# Altium schematic sheet Serializer_DS90UB913A.SchDoc
size A3; SheetNumber: 1; SheetTotal: 6
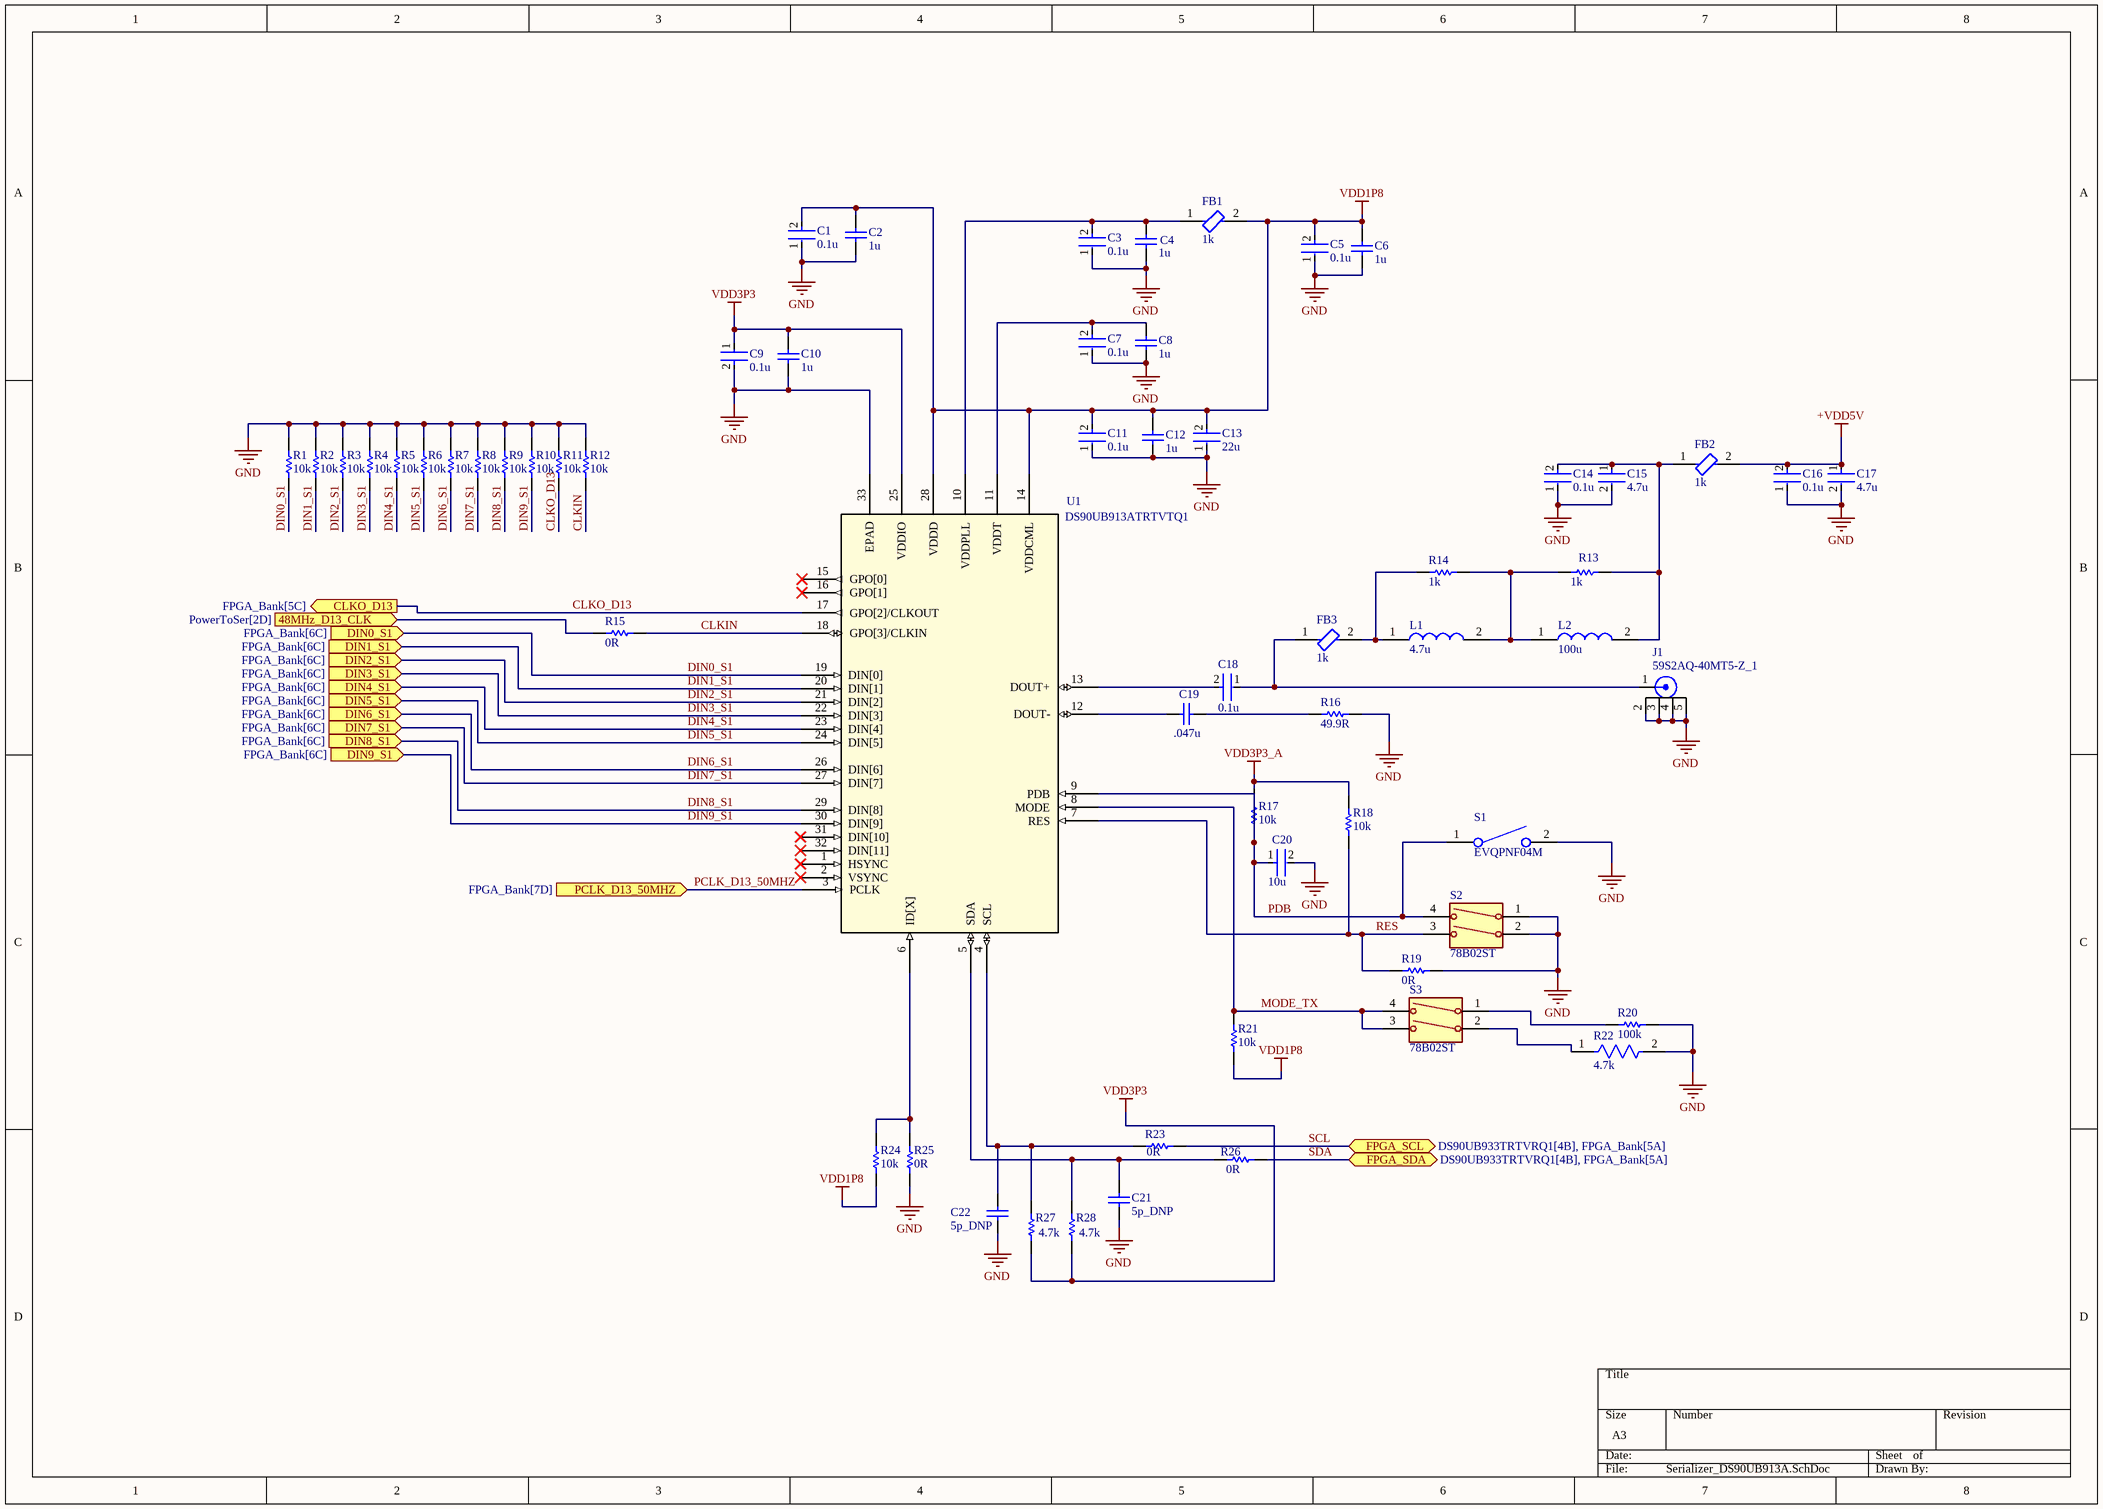
[diagram p0: Serializer_DS90UB913A.SchDoc]

## Parts
C1  0.1u  [FP-GRM15-MFG]
C2  1u  [CAPC1608X90X35ML10T15]
C3  0.1u  [FP-GRM15-MFG]
C4  1u  [CAPC1608X90X35ML10T15]
C5  0.1u  [FP-GRM15-MFG]
C6  1u  [CAPC1608X90X35ML10T15]
C7  0.1u  [FP-GRM15-MFG]
C8  1u  [CAPC1608X90X35ML10T15]
C9  0.1u  [FP-GRM15-MFG]
C10  1u  [CAPC1608X90X35ML10T15]
C11  0.1u  [FP-GRM15-MFG]
C12  1u  [CAPC1608X90X35ML10T15]
C13  22u  [FP-GCM32E-0_3-IPC_B]
C14  0.1u  [FP-GRM15-MFG]
C15  4.7u  [FP-GRM21B-0_15-MFG]
C16  0.1u  [FP-GRM15-MFG]
C17  4.7u  [FP-GRM21B-0_15-MFG]
C18  0.1u  [FP-GRM15-MFG]
C19  .047u  [CAPC1608X90X35ML10T15]
C20  10u  [FP-GRM21B-0_1-IPC_C]
C21  5p_DNP  [CAPC1005X55X25LL05T10]
C22  5p_DNP  [CAPC1005X55X25LL05T10]
FB1  1k  [FP-BLM18-0_15-t0_8-MFG]
FB2  1k  [FP-BLM18-0_15-t0_8-MFG]
FB3  1k  [FP-BLM18-0_15-t0_8-MFG]
J1  59S2AQ-40MT5-Z_1  [ROSENBERGER_59S2AQ-40MT5-Z_1]
L1  4.7u  [1008PS]
L2  100u  [MSS7341T104MLB]
R1  10k  [RESC1005X40X25ML05T05]
R2  10k  [RESC1005X40X25ML05T05]
R3  10k  [RESC1005X40X25ML05T05]
R4  10k  [RESC1005X40X25ML05T05]
R5  10k  [RESC1005X40X25ML05T05]
R6  10k  [RESC1005X40X25ML05T05]
R7  10k  [RESC1005X40X25ML05T05]
R8  10k  [RESC1005X40X25ML05T05]
R9  10k  [RESC1005X40X25ML05T05]
R10  10k  [RESC1005X40X25ML05T05]
R11  10k  [RESC1005X40X25ML05T05]
R12  10k  [RESC1005X40X25ML05T05]
R13  1k  [RESC1608X55X30LL15T15]
R14  1k  [RESC1608X55X30LL15T15]
R15  0R  [RESC1005X40X25LL05T05]
R16  49.9R  [RESC1608X55X30ML15T15]
R17  10k  [RESC1005X40X25ML05T05]
R18  10k  [RESC1005X40X25ML05T05]
R19  0R  [RESC1005X40X25LL05T05]
R20  100k  [RESC2013X70X40ML20T20]
R21  10k  [RESC1005X40X25ML05T05]
R22  4.7k  [FP-ERJ6GE-MFG]
R23  0R  [RESC1005X40X25LL05T05]
R24  10k  [RESC1005X40X25ML05T05]
R25  0R  [RESC1005X40X25LL05T05]
R26  0R  [RESC1005X40X25LL05T05]
R27  4.7k  [RESC1005X40X25LL05T05]
R28  4.7k  [RESC1005X40X25LL05T05]
S1  EVQPNF04M  [EVQ5PN05K]
S2  78B02ST  [78B02ST]
S3  78B02ST  [78B02ST]
U1  DS90UB913ATRTVTQ1  [RTV32_3P1X3P1_TEX]

## Ports
48MHz_D13_CLK (in, see PowerToSer[2D]), CLKO_D13 (out, see FPGA_Bank[5C]), DIN0_S1 (in, see FPGA_Bank[6C]), DIN1_S1 (in, see FPGA_Bank[6C]), DIN2_S1 (in, see FPGA_Bank[6C]), DIN3_S1 (in, see FPGA_Bank[6C]), DIN4_S1 (in, see FPGA_Bank[6C]), DIN5_S1 (in, see FPGA_Bank[6C]), DIN6_S1 (in, see FPGA_Bank[6C]), DIN7_S1 (in, see FPGA_Bank[6C]), DIN8_S1 (in, see FPGA_Bank[6C]), DIN9_S1 (in, see FPGA_Bank[6C]), FPGA_SCL (bidir, see DS90UB933TRTVRQ1[4B], FPGA_Bank[5A]), FPGA_SDA (bidir, see DS90UB933TRTVRQ1[4B], FPGA_Bank[5A]), PCLK_D13_50MHZ (in, see FPGA_Bank[7D])

## Nets
+VDD5V: C16.2 C17.1 FB2.2
GND: C1.1 C2.1 C3.1 C4.1 C5.1 C6.1 C7.1 C8.1 C9.2 C10.1 C11.1 C12.1 C13.1 C14.1 C15.2 C16.1 C17.2 C20.2 C21.1 C22.1 J1.2 J1.3 J1.4 J1.5 R1.2 R2.2 R3.2 R4.2 R5.2 R6.2 R7.2 R8.2 R9.2 R10.2 R11.2 R12.2 R16.2 R19.1 R20.2 R22.2 R25.1 S1.2(NO) S2.1(COM_1) S2.2(NO_1) U1.33(EPAD)
VDD1P8: C1.2 C2.2 C5.2 C6.2 C11.2 C12.2 C13.2 FB1.2 R21.1 R24.1 U1.14(VDDCML) U1.28(VDDD)
VDD3P3: C9.1 C10.2 R27.1 R28.1 U1.25(VDDIO)
VDD3P3_A: R17.2 R18.2
48MHz_D13_CLK: R15.2 ; port 48MHz_D13_CLK
CLKIN: R12.1 R15.1 U1.18(GPO[3]/CLKIN)
CLKO_D13: R11.1 U1.17(GPO[2]/CLKOUT) ; port CLKO_D13
DIN0_S1: R1.1 U1.19(DIN[0]) ; port DIN0_S1
DIN1_S1: R2.1 U1.20(DIN[1]) ; port DIN1_S1
DIN2_S1: R3.1 U1.21(DIN[2]) ; port DIN2_S1
DIN3_S1: R4.1 U1.22(DIN[3]) ; port DIN3_S1
DIN4_S1: R5.1 U1.23(DIN[4]) ; port DIN4_S1
DIN5_S1: R6.1 U1.24(DIN[5]) ; port DIN5_S1
DIN6_S1: R7.1 U1.26(DIN[6]) ; port DIN6_S1
DIN7_S1: R8.1 U1.27(DIN[7]) ; port DIN7_S1
DIN8_S1: R9.1 U1.29(DIN[8]) ; port DIN8_S1
DIN9_S1: R10.1 U1.30(DIN[9]) ; port DIN9_S1
MODE_TX: R21.2 S3.3(COM_2) S3.4(NO_2) U1.8(MODE)
PCLK_D13_50MHZ: U1.3(PCLK) ; port PCLK_D13_50MHZ
PDB: C20.1 R17.1 S1.1(COM) S2.4(NO_2) U1.9(PDB)
RES: R18.1 R19.2 S2.3(COM_2) U1.7(RES)
SCL: R23.1 ; port FPGA_SCL
SDA: R26.1 ; port FPGA_SDA
NetC3_2: C3.2 C4.2 FB1.1 U1.10(VDDPLL)
NetC7_2: C7.2 C8.2 U1.11(VDDT)
NetC14_2: C14.2 C15.1 FB2.1 L2.2 R13.2
NetC18_1: C18.1 FB3.1 J1.1
NetC18_2: C18.2 U1.13(DOUT+)
NetC19_1: C19.1 U1.12(DOUT-)
NetC19_2: C19.2 R16.1
NetC21_2: C21.2 R26.2 R28.2 U1.5(SDA)
NetC22_2: C22.2 R23.2 R27.2 U1.4(SCL)
NetFB3_2: FB3.2 L1.1 R14.1
NetL1_2: L1.2 L2.1 R13.1 R14.2
NetR20_1: R20.1 S3.1(COM_1)
NetR22_1: R22.1 S3.2(NO_1)
NetR24_2: R24.2 R25.2 U1.6(ID[X])

Not connected (* = marked no-connect by the designer): U1 1(HSYNC)* 2(VSYNC)* 15(GPO[0])* 16(GPO[1])* 31(DIN[10])* 32(DIN[11])*

## Library data of the parts
C1 C3 C5 C7 C9 C11 C14 C16 C18 = CMP-2100-03641-2: CAP CER 0.1UF 16V X7R 0402; Manufacturer Part Number: GRM155R71C104KA88D; Manufacturer: Murata; Standoff Height: 0mm; Tolerance: 10%; Voltage Rating: 16Vdc; Material: Ceramic; Capacitance: 0.10μF; Value: 0.10μF; RoHS: TRUE; Temperature Characteristic: X7R; Octopart: https://octopart.com/grm155r71c104ka88d-murata-196880; Digikey Description: CAP CER 0.1UF 16V X7R 0402; Device Class L3: Ceramic Capacitors; Height: 0.55mm; ComponentLink2Description: Datasheet; Temperature Range Low: -55°C; Ipc Land Pattern Name: CAPC10050X219; ComponentLink2URL: https://search.murata.co.jp/Ceramy/image/img/A01X/G101/ENG/GRM155R71H471KA01-01A.pdf; Device Class L1: Passive Components; Lead Free: yes; Category: Cap; Package: GRM15; Temperature: -55°C to +125°C; Device Class L2: Capacitors; Temperature Range High: +125°C; Mouser Description: 0402 0.1 uF 16V ±10 % Tolerance X7R SMT Multilayer Ceramic Capacitor
C2 C4 C6 C8 C10 C12 = CMP-2006-02460-1: Manufacturer: Murata; Part Number: GRM188R71E105KA12D
C13 = CMP-06035-049658-1: Ceramic Capacitor for Automotive 22uF ±10% 16VDC X7R 1210 Embossed T/R; Voltage Rating: 16V; Max Operating Temperature: 125°C; Case/Package: 1210; Packaging: Tape and Reel; Termination: SMD/SMT; Height: 2.5mm; Voltage Rating (DC): 16V; Length: 3.2mm; Width: 0.098inch; Voltage: 16V; Depth: 2.5mm; Package Quantity: 1; Mount: Surface Mount; Min Operating Temperature: -55°C; Case Code (Metric): 3225; Case Code (Imperial): 1210; Radiation Hardening: No; Thickness: 0.106inch; Ratings: AEC-Q200; Capacitance: 22uF; Tolerance: 10%; Dielectric: X7R; Lead Free: Lead Free
C15 C17 = CMP-2007-03401-2: CAP CER 4.7UF 16V X7R 0805; Material: Ceramic; Tolerance: 10%; Case Code (Metric): 2012; Voltage Rating: 16V; RoHS Compliant: Yes; Voltage Rating (DC): 16V; Case/Package: 0805; Number of Pins: 2; Thickness: 0.053inch; Voltage: 16V; Mount: Surface Mount; Packaging: Tape and Reel; Lead Free: Lead Free; Case Code (Imperial): 0805; Series: GRM; Width: 0.049inch; Package Quantity: 1; Construction: Flat; Min Operating Temperature: -55°C; Termination: SMD/SMT; Max Operating Temperature: 125°C; Length: 2mm; Dielectric: X7R; Depth: 1.25mm; REACH SVHC: No SVHC; Height: 1.25mm; Capacitance: 4.7uF
C19 = CMP-2006-02927-1: Manufacturer: Murata; Part Number: GRM188R71H473KA61D
C20 = CMP-2007-03453-2: Chip Multilayer Ceramic Capacitors for General Purpose, 0805, 10uF, X5R, 15%, 10%, 16V; Radiation Hardening: No; Thickness: 0.053inch; Voltage Rating (DC): 16V; Lead Free: Lead Free; Package Quantity: 1; Width: 1.25mm; Case Code (Imperial): 0805; Depth: 1.25mm; Packaging: Tape and Reel; Dielectric: X5R; Max Operating Temperature: 85°C; Tolerance: 10%; Voltage Rating: 16V; Voltage: 16V; Capacitance: 10uF; Height: 1.25mm; Case Code (Metric): 2012; Material: Ceramic; Mount: Surface Mount; Case/Package: 0805; REACH SVHC: No SVHC; Length: 2mm; Min Operating Temperature: -55°C; Termination: SMD/SMT
C21 C22 = CMP-2008-04391-1: Manufacturer: Murata; Part Number: GRM1555C1H5R0CA01D
FB1-FB3 = CMP-0686-00457-3: Chip Ferrite Bead, 0603, 1000Ω @ 100MHz, 0.5Ω, 25%, 450mABLM18AG102SN1D; Number of Circuits: 1; Max DC Current: 400mA; Shielding: Unshielded; DC Resistance (DCR): 500mR; Material: Steel; DC Resistance-Max: 700mR; Impedance: 1kR; Case Code (Imperial): 0603; Max Current Rating: 400mA; Frequency: 100MHz; Min Operating Temperature: -55°C; Case/Package: 0603; Depth: 0.8mm; Lead Free: Lead Free; Core Material: Ferrite; Current Rating: 400mA; Resistance: 500mR; Case Code (Metric): 1608; DC Current: 400mA; Package Quantity: 1; Packaging: Tape and Reel; Width: 0.8mm; Military Standard: Not; Height: 0.8mm; Series: BLM18A; Max Operating Temperature: 125°C; Tolerance: 25%; Termination: SMD/SMT; Test Frequency: 100MHz; Number of Lines: 1; Number of Pins: 2; REACH SVHC: No SVHC; Length: 1.6mm; Radiation Hardening: No
J1 = 59S2AQ-40MT5-Z_1: RF Connectors / Coaxial Connectors Plug PC-Board SMD Right AngleZWatrBlue; Package: None; Price: None; Value: *; MP: 59S2AQ-40MT5-Z_1; Availability: Unavailable
L1 = 1008PS-472KLB: Inductor; Manufacturer_Name: COILCRAFT; Datasheet Link: https://www.coilcraft.com/pdfs/1008ps.pdf; Manufacturer_Part_Number: 1008PS-472KLB; Mouser Part Number: 994-1008PS-472KLB; Mouser Price/Stock: https://www.mouser.co.uk/ProductDetail/Coilcraft/1008PS-472KLB?qs=zCSbvcPd3pZjtFGTYwqcAw%3D%3D
L2 = MSS7341T-104MLB: Inductor; Manufacturer_Name: COILCRAFT; Manufacturer_Part_Number: MSS7341T-104MLD; Datasheet Link: https://componentsearchengine.com/Datasheets/2/MSS7341T-104MLD.pdf; Height: 4.1mm; Mouser Part Number: 994-MSS7341T-104MLD; Mouser Price/Stock: https://www.mouser.co.uk/ProductDetail/Coilcraft/MSS7341T-104MLD?qs=zCSbvcPd3paCy6uSM7W%2FOg%3D%3D
R1-R12 R17 R18 R21 R24 = CMP-2002-00433-1: Part Number: ERJ-2GEJ103X; Manufacturer: Panasonic
R13 R14 = CMP-2000-00180-1: Part Number: ERJ-3EKF1001V; Manufacturer: Panasonic
R15 R19 R23 R25 R26 = CMP-2000-07451-1: Chip Resistor, 0 Ohm, 0.1 W, -55 to 155 degC, 0402 (1005 Metric), RoHS, Tape and Reel; Manufacturer: Panasonic; Voltage Rating (DC): 50V; Temperature Coefficient: 600ppm/��C; Max Power Dissipation: 100mW; Resistance: 0mOhm; Tolerance: 5%; Number of Terminations: 2; Mount: SurfaceMount; Height: 0.35mm; Packaging: TapeandReel; Contact Plating: Tin; Manufacturer URL: http://www.panasonic.com/; Composition: ThickFilm; Max Operating Temperature: 155degC; REACH SVHC: NoSVHC; Case/Package: 0402; Package Reference: 402; Depth: 0.5mm; Package Description: 2-Pin Surface Mount Device, Body 1 x 0.5 mm; Datasheet URL: https://industrial.panasonic.com/cdbs/www-data/pdf/RDA0000/AOA0000C301.pdf; RoHSCompliant: True; Case Code (Imperial): 0402; Military Standard: Not; Min Operating Temperature: -55degC; Power Rating: 100mW; Datasheet Version: 03/2015; Length: 1mm; Case Code (Metric): 1005; Termination: SMD/SMT; Mounting Technology: SurfaceMount; Voltage Rating: 50V; Width: 0.02inch; Package Quantity: 1; Lead Free: LeadFree; Radiation Hardening: No
R16 = CMP-2000-00538-1: Manufacturer: Panasonic; Part Number: ERJ-3EKF49R9V
R20 = CMP-2001-04377-1: Part Number: ERJ-6ENF1003V; Manufacturer: Panasonic
R22 = CMP-2001-00420-2: RES SMD 4.7K OHM 5% 1/8W 0805; Power Rating: 125mW; Voltage Rating (DC): 150V; Temperature Coefficient: 200ppm/°C; Resistance: 4.7kR; Lead Free: Lead Free; Length: 2mm; Resistance Tolerance: 5%; Tolerance: 5%; Mount: Surface Mount; Number of Terminations: 2; Technology: THICK FILM; Case Code (Metric): 2012; Resistor Type: Thick Film; Max Power Dissipation: 125mW; Series: ERJ; Radiation Hardening: No; Min Operating Temperature: -55°C; RoHS Compliant: Yes; Case/Package: 0805; Package Quantity: 5000; Size Code: 0805; Width: 0.049inch; Voltage Rating: 150V; Contact Plating: Tin; Military Standard: Not; Height: 0.6mm; Construction: Rectangular; Packaging: Tape and Reel; Max Operating Temperature: 155°C; Termination: SMD/SMT; REACH SVHC: No SVHC; Case Code (Imperial): 0805; Depth: 1.25mm
R27 R28 = CMP-2002-01154-4: Chip Resistor, 4.7 KOhm, +/- 1%, 0.1 W, -55 to 155 degC, 0402 (1005 Metric), RoHS, Tape and Reel; PartNumber: ERJ-2RKF4701X; Voltage Rating: 50 V; Case\/Package: 0402; Power Rating: 100 mW; Height: 0.35 mm; Mounting Technology: Surface Mount; REACH SVHC: Yes; Resistance: 4.7 KOhm; Max Operating Temperature: 155 degC; ComponentLink1Description: Manufacturer URL; ComponentLink2Description: Datasheet; Pins: 2; PackageReference: 0402; Tolerance: 1%; Case Code (Imperial): 0402; Length: 1 mm; PackageDescription: 2-Pin Surface Mount Device, Body 1 x 0.5 mm; RoHSCompliant: true; Package Quantity: 1; Radiation Hardening: No; DatasheetVersion: 04/2015; Width: 0.5 mm; Case Code (Metric): 1005; Mount: Surface Mount; ComponentLink1URL: http://www.panasonic.com/; Min Operating Temperature: -55 degC; Packaging: Cut Tape; ComponentLink2URL: http://industrial.panasonic.com/cdbs/www-data/pdf/RDA0000/AOA0000C86.pdf
S1 = EVQPNF04M: Switch; Manufacturer_Name: Panasonic; Datasheet Link: https://industrial.panasonic.com/cdbs/www-data/pdf/ATK0000/ATK0000C376.pdf; Manufacturer_Part_Number: EVQPNF04M
S2 S3 = 78B02ST: PCB Slide Switch Single Pole Single Throw (SPST) 150 mA Slide; Manufacturer_Name: Grayhill; Geometry.Height: 7.49mm; Mouser Part Number: 706-78B02ST; Mouser Price/Stock: https://www.mouser.co.uk/ProductDetail/Grayhill/78B02ST?qs=ls7QRyWmRk63wsT9ZvgLUg%3D%3D; Manufacturer_Part_Number: 78B02ST; Datasheet Link: https://datasheet.datasheetarchive.com/originals/distributors/SFDatasheet-7/sf-000148477.pdf
U1 = DS90UB913ATRTVTQ1: 25- to 100-MHz, 10-bit & 12-bit FPD-Link III serializer 32-WQFN -40 to 105; Manufacturer_Name: Texas Instruments; Copyright: Copyright (C) 2025 Ultra Librarian. All rights reserved.; Manufacturer_Part_Number: DS90UB913ATRTVTQ1; RefDes: RefDes; Type: Type